# Altium schematic sheet ADC.SchDoc: Analog to Digital Converter
size A4; Date: 06.10.2023; ApprovedBy: M.Sc. Tobias Wirth; CheckedBy: M.Sc. Tobias Wirth; Author: M.Sc. Tobias Wirth; CompanyName: University of Stuttgart; DrawnBy: M.Sc. Tobias Wirth; Engineer: M.Sc. Tobias Wirth; Organization: IIS; Address1: Pfaffenwaldring 47; Address2: 70569 Stuttgart; Revision: V1.1; SheetNumber: 6; SheetTotal: 11; ProjectNameAlt: AUS - NMR System; Time: 16:00; ImagePath: N/A; Application_BuildNumber: N/A
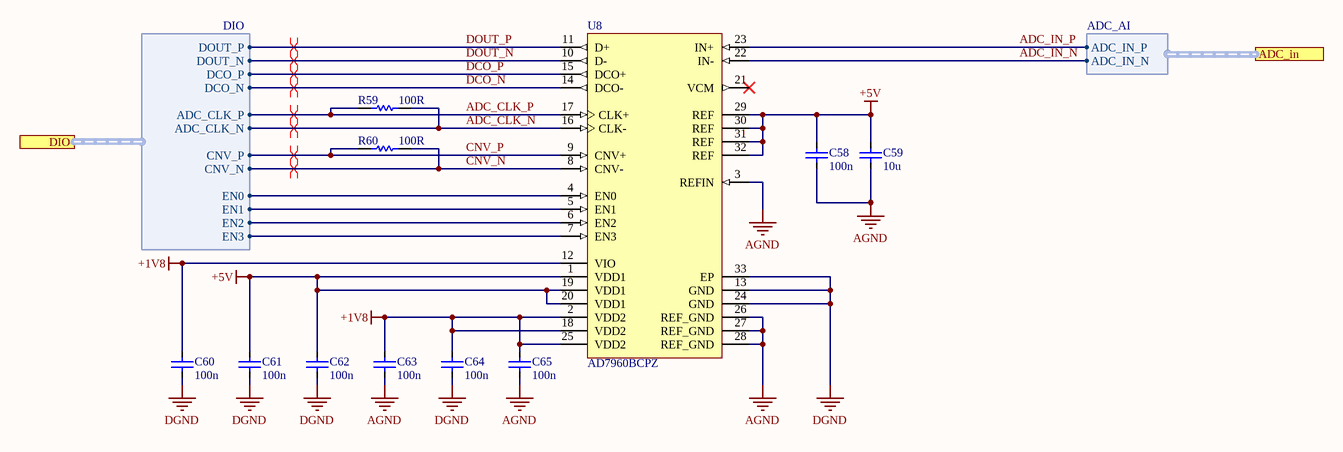
[diagram p0: ADC.SchDoc]

## Parts
C58  100n  [CAP_0402]
C59  10u  [CAP_0603]
C60  100n  [CAP_0402]
C61  100n  [CAP_0402]
C62  100n  [CAP_0402]
C63  100n  [CAP_0402]
C64  100n  [CAP_0402]
C65  100n  [CAP_0402]
R59  100R  [RES_0402]
R60  100R  [RES_0402]
U8  AD7960BCPZ  [ADI-CP-32-7_M]

## Ports
ADC_in (harness ADC_AI), DIO (harness DIO)

## Harnesses
DIO: ADC_CLK_N, ADC_CLK_P, CNV_N, CNV_P, DCO_N, DCO_P, DOUT_N, DOUT_P, EN0, EN1, EN2, EN3
ADC_AI: ADC_IN_P, ADC_IN_N

## Nets
+1V8: C60.1 C63.1 C64.1 C65.1 U8.2(VDD2) U8.12(VIO) U8.18(VDD2) U8.25(VDD2)
+5V: C58.1 C59.1 C61.1 C62.1 U8.1(VDD1) U8.19(VDD1) U8.20(VDD1) U8.29(REF) U8.30(REF) U8.31(REF) U8.32(REF)
AGND: C58.2 C59.2 C63.2 C65.2 U8.3(REFIN) U8.26(REF_GND) U8.27(REF_GND) U8.28(REF_GND)
DGND: C60.2 C61.2 C62.2 C64.2 U8.13(GND) U8.24(GND) U8.33(EP)
ADC_CLK_N: R59.2 U8.16(CLK-) ; port DIO.ADC_CLK_N
ADC_CLK_P: R59.1 U8.17(CLK+) ; port DIO.ADC_CLK_P
ADC_IN_N: U8.22(IN-) ; port ADC_in.ADC_IN_N
ADC_IN_P: U8.23(IN+) ; port ADC_in.ADC_IN_P
CNV_N: R60.2 U8.8(CNV-) ; port DIO.CNV_N
CNV_P: R60.1 U8.9(CNV+) ; port DIO.CNV_P
DCO_N: U8.14(DCO-) ; port DIO.DCO_N
DCO_P: U8.15(DCO+) ; port DIO.DCO_P
DOUT_N: U8.10(D-) ; port DIO.DOUT_N
DOUT_P: U8.11(D+) ; port DIO.DOUT_P
NetU8_4: U8.4(EN0) ; port DIO.EN0
NetU8_5: U8.5(EN1) ; port DIO.EN1
NetU8_6: U8.6(EN2) ; port DIO.EN2
NetU8_7: U8.7(EN3) ; port DIO.EN3

Not connected (* = marked no-connect by the designer): U8 21(VCM)*

## Layout directives
differential pair; net class ADC_OUT: ADC_CLK_N, ADC_CLK_P, CNV_N, CNV_P, DCO_N, DCO_P, DOUT_N, DOUT_P

## Notes on the sheet
- Title
- Size
- Date:
- Sheet
- A4
- of
- Project
- Drawn By:
- Revision:

## Library data of the parts
C58-C65 = Cap: Supplier: *; Part Number: *
  C58 C60-C65: Value: 100n
  C59: Value: 10u
R59 R60 = Res: Part Number: *; Supplier: *; Value: 100R
U8 = AD7960: Single 18-Bit PulSAR Differential Analog-to-Digital Converter with Serial LVDS Interface, 5 MSPS, -40 to 85 degC, CP-32-7, RoHS, Tray; Manufacturer: Analog Devices; Full Power BW: 28 MHz; # of Channels: 1; Throughput Rate: 5 MSPS; Dynamic Range: 100 dB; Resolution: 18 Bits; ComponentLink1Description: Manufacturer URL; ComponentLink3Description: Package Specification; PartNumber: AD7960BCPZ; ComponentLink1URL: http://www.analog.com/en/index.html; ComponentLink2URL: http://www.analog.com/static/imported-files/data_sheets/AD7960.pdf; ComponentLink3URL: http://www.analog.com/static/imported-files/packages/CP_32_7.pdf; RoHS: TRUE; DatasheetVersion: Rev. A; ADC_Sample_Rate: 5 MSPS; Mounting Technology: Surface Mount; Packing: Tray; PackageReference: CP-32-7; Temperature Range: -40 to 85 degC; ComponentLink2Description: Datasheet; PackageDescription: 32-Pin Lead Frame Chip Scale Package, Body 5 x 5 mm, Pitch 0.5 mm; PackageVersion: 112408-A; Supplier 1: Mouser; Supplier Part Number 1: 584-AD7960BCPZ